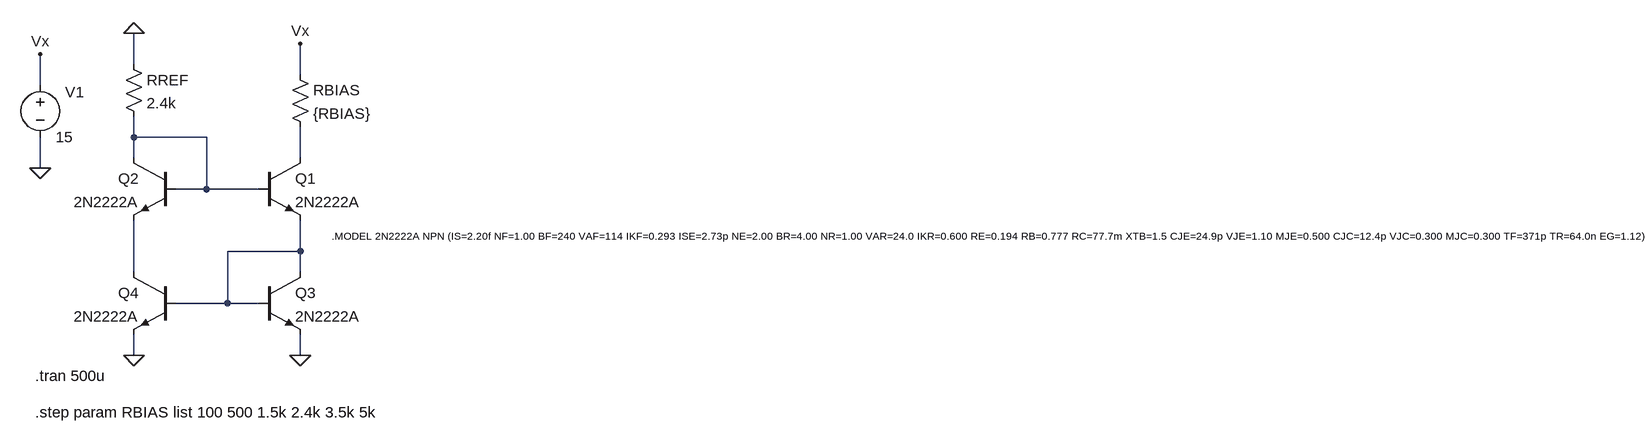
[diagram p0: schematic 4Qcurrsrc_OutputResis.asc]
4Qcurrsrc_OutputResis.asc, the LTspice schematic file:
Version 4
SHEET 1 2688 760
WIRE 224 208 224 160
WIRE 480 224 480 176
WIRE 80 240 80 192
WIRE 224 320 224 288
WIRE 336 320 224 320
WIRE 224 352 224 320
WIRE 480 352 480 304
WIRE 80 368 80 320
WIRE 336 400 336 320
WIRE 336 400 288 400
WIRE 416 400 336 400
WIRE 480 496 480 448
WIRE 480 496 368 496
WIRE 224 528 224 448
WIRE 480 528 480 496
WIRE 368 576 368 496
WIRE 368 576 288 576
WIRE 416 576 368 576
WIRE 224 656 224 624
WIRE 480 656 480 624
FLAG 80 368 0
FLAG 224 160 0
FLAG 224 656 0
FLAG 480 656 0
FLAG 480 176 Vx
FLAG 80 192 Vx
SYMBOL npn 416 352 R0
SYMATTR InstName Q1
SYMATTR Value 2N2222A
SYMBOL npn 288 352 M0
SYMATTR InstName Q2
SYMATTR Value 2N2222A
SYMBOL voltage 80 224 R0
WINDOW 0 38 27 Left 2
SYMATTR InstName V1
SYMATTR Value 15
SYMBOL res 208 192 R0
SYMATTR InstName RREF
SYMATTR Value 2.4k
SYMBOL res 464 208 R0
SYMATTR InstName RBIAS
SYMATTR Value {RBIAS}
SYMBOL npn 416 528 R0
SYMATTR InstName Q3
SYMATTR Value 2N2222A
SYMBOL npn 288 528 M0
SYMATTR InstName Q4
SYMATTR Value 2N2222A
TEXT 528 472 Left 1 !.MODEL 2N2222A NPN (IS=2.20f NF=1.00 BF=240 VAF=114 IKF=0.293 ISE=2.73p NE=2.00 BR=4.00 NR=1.00 VAR=24.0 IKR=0.600 RE=0.194 RB=0.777 RC=77.7m XTB=1.5 CJE=24.9p VJE=1.10 MJE=0.500 CJC=12.4p VJC=0.300 MJC=0.300 TF=371p TR=64.0n EG=1.12)
TEXT 72 688 Left 2 !.tran 500u
TEXT 72 744 Left 2 !.step param RBIAS list 100 500 1.5k 2.4k 3.5k 5k

The netlist it stands for:
* 4Qcurrsrc_OutputResis.asc
Q1 N002 N001 N003 0 2N2222A
Q2 N001 N001 N004 0 2N2222A
V1 Vx 0 15
RREF 0 N001 2.4k
RBIAS Vx N002 {RBIAS}
Q3 N003 N003 0 0 2N2222A
Q4 N004 N003 0 0 2N2222A
.model NPN NPN
.model PNP PNP
.lib standard.bjt
.MODEL 2N2222A NPN (IS=2.20f NF=1.00 BF=240 VAF=114 IKF=0.293 ISE=2.73p NE=2.00 BR=4.00 NR=1.00 VAR=24.0 IKR=0.600 RE=0.194 RB=0.777 RC=77.7m XTB=1.5 CJE=24.9p VJE=1.10 MJE=0.500 CJC=12.4p VJC=0.300 MJC=0.300 TF=371p TR=64.0n EG=1.12)
.tran 500u
.step param RBIAS list 100 500 1.5k 2.4k 3.5k 5k
.backanno
.end